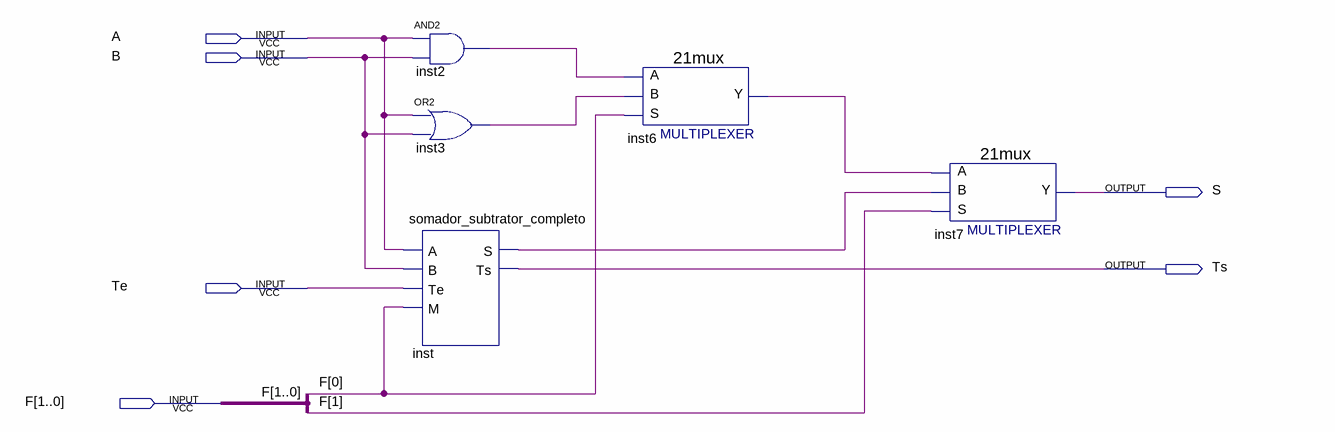
[diagram p0: schematic sheet]
// Quartus schematic ula_simples.bdf as structural Verilog: 5 symbols, 6 pins
module ula_simples (
  input  A,
  input  B,
  input  Te,
  input  [1:0] F,
  output S,
  output Ts
);

  wire inst2_out, inst3_out, inst6_y, inst_s;

  and inst2 (inst2_out, A, B);
  or inst3 (inst3_out, A, B);
  somador_subtrator_completo inst (.A(A), .B(B), .Te(Te), .M(F[0]), .S(inst_s), .Ts(Ts));
  \21mux  inst6 (.S(F[0]), .B(inst3_out), .A(inst2_out), .Y(inst6_y));
  \21mux  inst7 (.S(F[1]), .B(inst_s), .A(inst6_y), .Y(S));
endmodule
